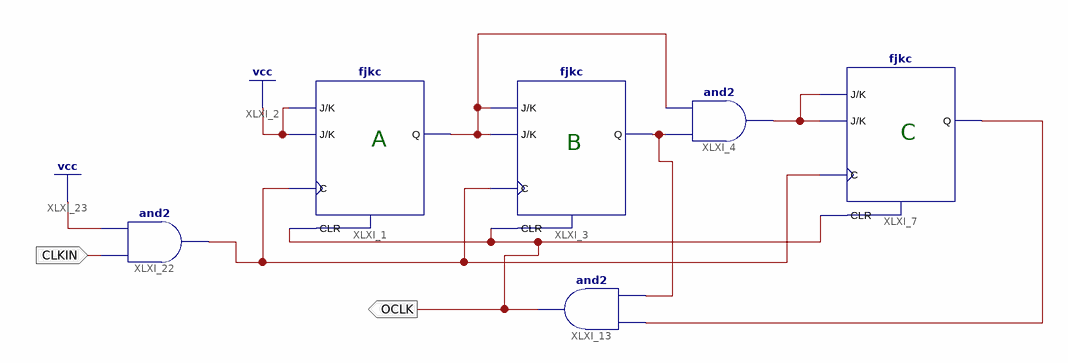
[diagram p0: schematic sheet 1]
// Xilinx ISE schematic MOD6.sch (spartan6) as structural Verilog: 6 symbols, 2 ports
module MOD6 (
  input  CLKIN,
  output OCLK
);

  wire XLXN_4, XLXN_5, XLXN_8, XLXN_19, XLXN_37;

  fjkc XLXI_1 (.C(XLXN_37), .CLR(OCLK), .J(1'b1), .K(1'b1), .Q(XLXN_4));
  fjkc XLXI_3 (.C(XLXN_37), .CLR(OCLK), .J(XLXN_4), .K(XLXN_4), .Q(XLXN_19));
  and XLXI_4 (XLXN_8, XLXN_19, XLXN_4);
  fjkc XLXI_7 (.C(XLXN_37), .CLR(OCLK), .J(XLXN_8), .K(XLXN_8), .Q(XLXN_5));
  and XLXI_13 (OCLK, XLXN_5, XLXN_19);
  and XLXI_22 (XLXN_37, CLKIN, 1'b1);

  // Notes on the sheet:
  //   C
  //   A
  //   B
endmodule
